# EAGLE design MRCS-BB-Wemos (EAGLE 7.7.0)
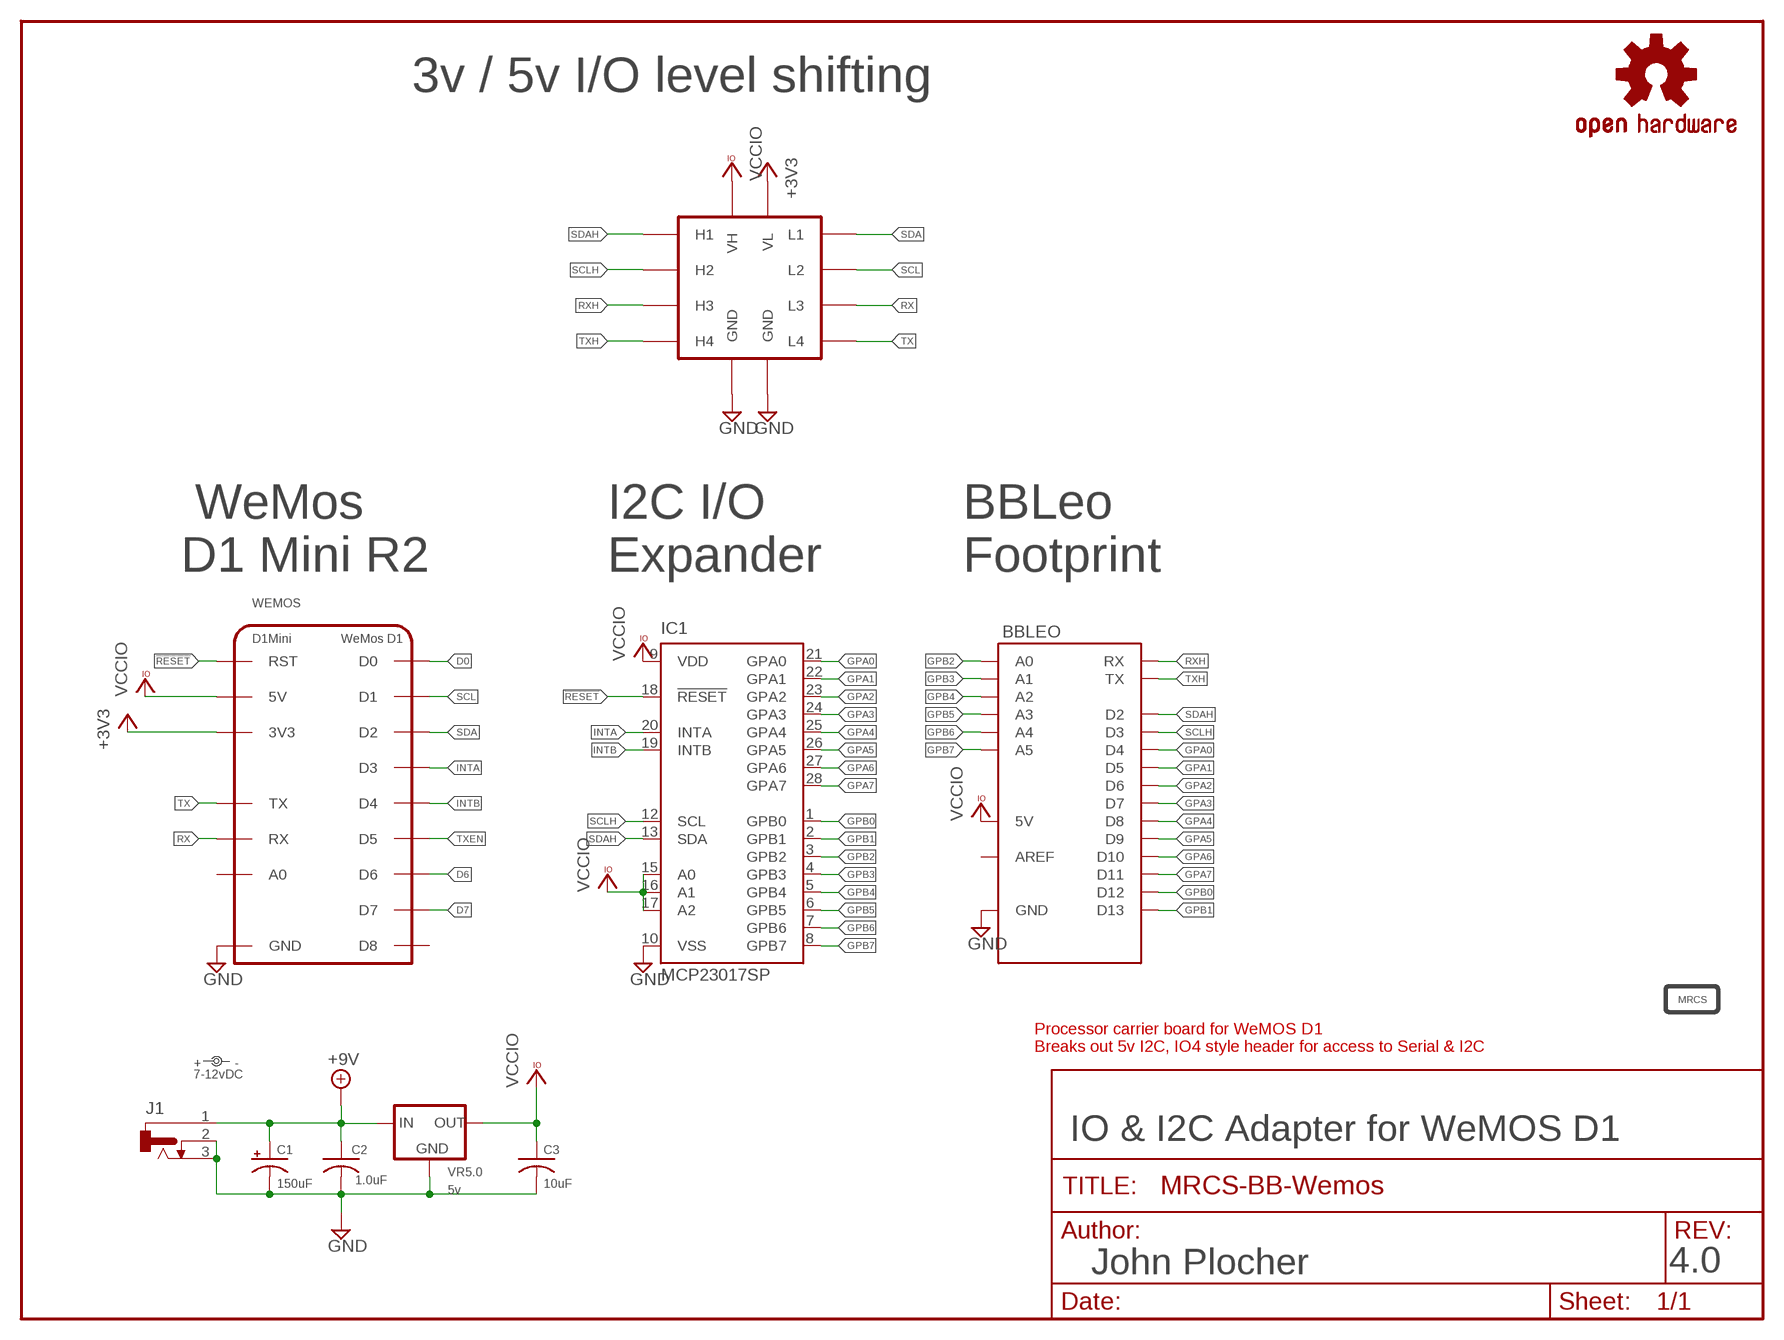
[diagram p0: schematic, sheet 1]

## Parts
BBLEO  ARDUINO-BBLEO  [ARDUINO-BBLEO]
C1  150uF  CAP-POLPTH-5MM  [E5-10.5]
C2  1.0uF  CAPPTH1  [C050-024X044]
C3  10uF  CAPPTH1  [C050-024X044]
IC1  MCP23017SP  [DIL28-3]
J1  CONNECTOR-DC-POWER-RA  [DCJ0202]
LABEL1  7-12vDC  DOC-POWER_LABEL  [PWR_LABEL]
LS2  I2C-LEVELSHIFTER  [MODULE]
OSHW1  DOC-OSHW-LOGO-L  [OSHW-LOGO-L]
U$1  DOC-MRCS-LOGOTOP  [MRCS-LOGO]
VR5.0  5v  VREG-PTH-RA-  [TO-220-RA]
WEMOS  D1Mini  WEMOS-D1V1  [WEMOS-D1]

## Nets
!RESET: IC1.18(!RESET) WEMOS.RST
+3V3: LS2.LV(VL) WEMOS.3V3
+9V [Feed]: C1.+ C2.1 J1.1 VR5.0.IN
D0 [signals]: WEMOS.D0
D6 [signals]: WEMOS.D6
D7 [signals]: WEMOS.D7
GND [signals]: BBLEO.GND@0(GND) BBLEO.GND@1(GND) BBLEO.GND@2(GND) BBLEO.GND@3(GND) BBLEO.GND@4(GND) C1.- C2.2 C3.2 IC1.10(VSS) J1.2 J1.3 LS2.GND@0(GND) LS2.GND@1(GND) VR5.0.GND WEMOS.GND
GPA0: BBLEO.D4 IC1.21(GPA0)
GPA1: BBLEO.D5 IC1.22(GPA1)
GPA2: BBLEO.D6 IC1.23(GPA2)
GPA3: BBLEO.D7 IC1.24(GPA3)
GPA4: BBLEO.D8 IC1.25(GPA4)
GPA5: BBLEO.D9 IC1.26(GPA5)
GPA6: BBLEO.D10 IC1.27(GPA6)
GPA7: BBLEO.D11 IC1.28(GPA7)
GPB0: BBLEO.D12 IC1.1(GPB0)
GPB1: BBLEO.D13 IC1.2(GPB1)
GPB2: BBLEO.A0 IC1.3(GPB2)
GPB3: BBLEO.A1 IC1.4(GPB3)
GPB4: BBLEO.A2 IC1.5(GPB4)
GPB5: BBLEO.A3 IC1.6(GPB5)
GPB6: BBLEO.A4 IC1.7(GPB6)
GPB7: BBLEO.A5 IC1.8(GPB7)
INTA [signals]: IC1.20(INTA) WEMOS.D3
INTB [signals]: IC1.19(INTB) WEMOS.D4
RX [signals]: LS2.L3 WEMOS.RX
RXH [signals]: BBLEO.RX LS2.H3
SCL [signals]: LS2.L2 WEMOS.D1
SCLH [signals]: BBLEO.SCL(D3) IC1.12(SCL) LS2.H2
SDA [signals]: LS2.L1 WEMOS.D2
SDAH [signals]: BBLEO.SDA(D2) IC1.13(SDA) LS2.H1
TX [signals]: LS2.L4 WEMOS.TX
TXEN [signals]: WEMOS.D5
TXH [signals]: BBLEO.TX LS2.H4
VCCIO [Power]: BBLEO.+5V@1(5V) BBLEO.+5V@2(5V) BBLEO.+5V@3(5V) BBLEO.+5V@4(5V) C3.1 IC1.9(VDD) IC1.15(A0) IC1.16(A1) IC1.17(A2) LS2.HV(VH) VR5.0.OUT WEMOS.5V
Unconnected: BBLEO.AR(AREF) WEMOS.A0 WEMOS.D8

## Notes on the sheet
- 3v / 5v I/O level shifting
- WeMos
  D1 Mini R2
- I2C I/O
  Expander
- BBLeo
  Footprint
- Processor carrier board for WeMOS D1
  Breaks out 5v I2C, IO4 style header for access to Serial & I2C
- IO & I2C Adapter for WeMOS D1
- John Plocher | 4.0

## Library data of the parts
BBLEO = SPCoast:ARDUINO-BBLEO
C1 = SPCoast:CAP-POL*
C2 C3 = SPCoast:CAP*
IC1 = SPCoast:MCP23017: http://ww1.microchip.com/downloads/en/DeviceDoc/21952a.pdf Source: http://ww1.microchip.com/downloads/en/DeviceDoc/21952a.pdf; MF: MICROCHIP; MPN: MCP23017-E/SP; OC_FARNELL: 1332088; OC_NEWARK: 31K2959
J1 = SPCoast:CONNECTOR-DC-POWER: DC POWER JACK
LABEL1 = SPCoast:DOC-POWER_LABEL
LS2 = SPCoast:I2C-LEVELSHIFTER
OSHW1 = SPCoast:DOC-OSHW-LOGO-: Open Source Hardware Logo This logo indicates the piece of hardware it is found on incorporates a OSHW license and/or adheres to the definition of open source hardware http://freedomdefined.org/OSHW Creative Commons - Attribution - ShareAlike 3.0
U$1 = SPCoast:DOC-MRCS-LOGO
VR5.0 = SPCoast:VREG-?-*: Voltage Regulator Standard linear regulator. 7805 uses IGO pinout LM1117 uses GOI pinout
WEMOS = SPCoast:WEMOS-D1

## Net classes
0 default: width 0.254 mm, drill 0.5 mm, clearance 0.203 mm
1 Power: width 0.254 mm, drill 0.8 mm, clearance 0.254 mm
2 signals: width 0.254 mm, drill 0.6 mm, clearance 0.254 mm
3 Feed: width 1.016 mm, drill 1.4 mm, clearance 0.254 mm

## Board
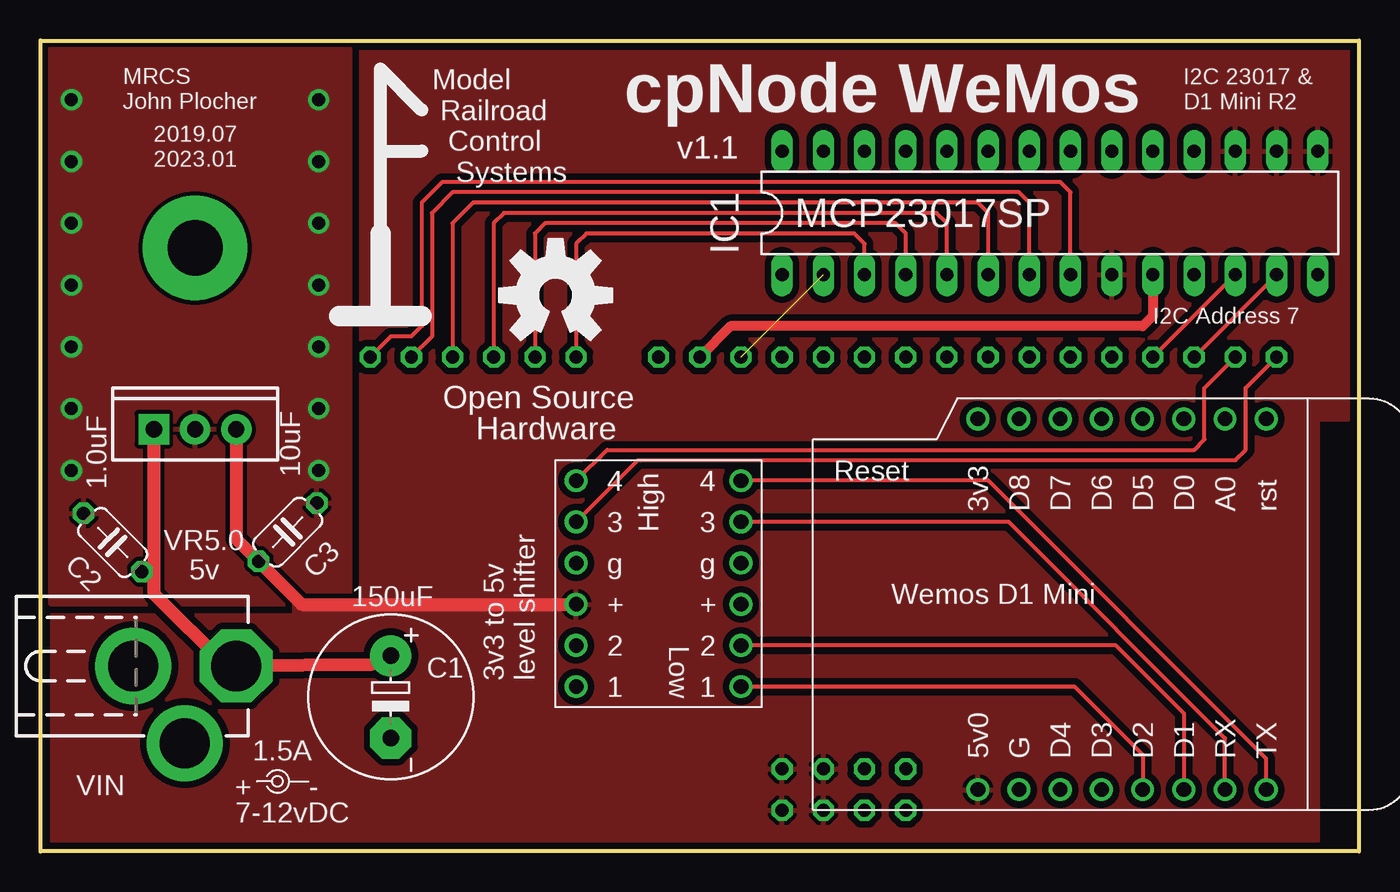
[diagram p1: board, top side]
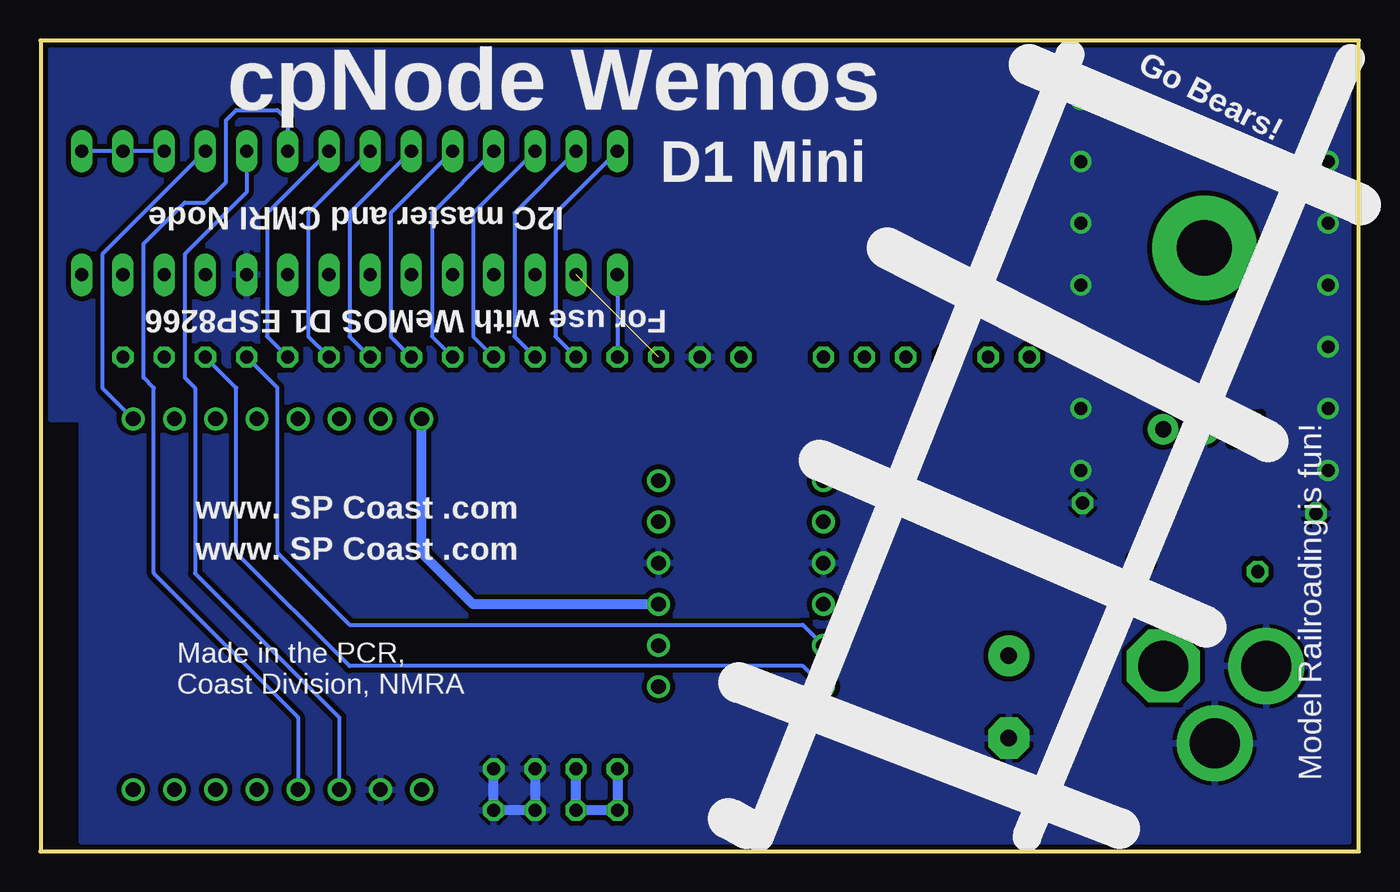
[diagram p2: board, bottom side, seen from below]

Size 81.28 x 50 mm. Coordinates in mm from the lower left corner, seen from the top.
Outline: 0,0 0,50 81.28,50 81.28,0 0,0
Copper layers (1*16): Top 0.035mm / dielectric 1.5mm / Bottom 0.035mm
Design rules "Fusion_eagle_rule_v1.1 *": minimum track width 8mil, minimum drill 0.6mm, track to track 6mil, track to pad 6mil, pad to pad 10mil, via to via 10mil, smd to smd 10mil, copper to edge 10mil, drill to drill 10mil, minimum pad ring 10mil, minimum via ring 10mil, stop-mask expansion 2mil, vias tented up to drill 100mil, thermal gap 10mil

### Footprints (pad centres in the part's own frame; a part is rotated, then mirrored left to right if it is on the bottom)
ARDUINO-BBLEO = drill 0.8 octagon: +5V@1 40.64,5.08; +5V@2 40.64,2.54; +5V@3 38.1,5.08; +5V@4 38.1,2.54; A0 25.4,30.48; A1 22.86,30.48; A2 20.32,30.48; A3 17.78,30.48; A4 15.24,30.48; A5 12.7,30.48; AR 30.48,30.48; D4 58.42,30.48; D5 55.88,30.48; D6 53.34,30.48; D7 50.8,30.48; D8 48.26,30.48; D9 45.72,30.48; D10 43.18,30.48; D11 40.64,30.48; D12 38.1,30.48; D13 35.56,30.48; GND@0 33.02,30.48; GND@1 43.18,5.08; GND@2 45.72,5.08; GND@3 43.18,2.54; GND@4 45.72,2.54; RX 68.58,30.48; SCL 60.96,30.48; SDA 63.5,30.48; TX 66.04,30.48
E5-10.5 = drill 1.016 pad 2.54: + -2.54,0 | drill 1.016 pad 2.54 octagon: - 2.54,0
C050-024X044 = drill 0.813 octagon: 1 -2.54,0; 2 2.54,0
DIL28-3 = drill 0.813 long: 1 -16.51,-3.81; 2 -13.97,-3.81; 3 -11.43,-3.81; 4 -8.89,-3.81; 5 -6.35,-3.81; 6 -3.81,-3.81; 7 -1.27,-3.81; 8 1.27,-3.81; 9 3.81,-3.81; 10 6.35,-3.81; 11 8.89,-3.81; 12 11.43,-3.81; 13 13.97,-3.81; 14 16.51,-3.81; 15 16.51,3.81; 16 13.97,3.81; 17 11.43,3.81; 18 8.89,3.81; 19 6.35,3.81; 20 3.81,3.81; 21 1.27,3.81; 22 -1.27,3.81; 23 -3.81,3.81; 24 -6.35,3.81; 25 -8.89,3.81; 26 -11.43,3.81; 27 -13.97,3.81; 28 -16.51,3.81
DCJ0202 = drill 3.1 pad 4.5 octagon: 1 0,3.175 | drill 3.1 pad 4.7: 2 4.763,0; 3 0,-3.175
MODULE = drill 0.9: GND@0 -5.08,1.27; GND@1 5.08,1.27; H1 -5.08,-6.35; H2 -5.08,-3.81; H3 -5.08,3.81; H4 -5.08,6.35; HV -5.08,-1.27; L1 5.08,-6.35; L2 5.08,-3.81; L3 5.08,3.81; L4 5.08,6.35; LV 5.08,-1.27
TO-220-RA = drill 1 pad 1.88: GND 0,0; OUT 2.54,0 | drill 1 pad 1.88 square: IN -2.54,0
WEMOS-D1 = drill 0.9: 3V3 -11.43,-7.62; 5V 11.43,-7.62; A0 -11.43,7.62; D0 -11.43,5.08; D1 11.43,5.08; D2 11.43,2.54; D3 11.43,0; D4 11.43,-2.54; D5 -11.43,2.54; D6 -11.43,0; D7 -11.43,-2.54; D8 -11.43,-5.08; GND 11.43,-5.08; RST -11.43,10.16; RX 11.43,7.62; TX 11.43,10.16

### Placement (x,y rotation side)
BBLEO  7.62,0 0 top
C1  21.59,9.53 270 top
C2  4.45,19.05 135 top
C3  15.24,19.68 45 top
IC1  62.23,39.37 0 top
J1  8.89,11.43 270 top
LABEL1  14.61,4.32 90 top
LS2  38.1,16.51 0 top
OSHW1  31.75,34.29 0 top
U$1  20.95,33.02 0 top
VR5.0  9.53,26.04 0 top
WEMOS  65.41,15.24 270 top

### Tracks (layer width: path | path; a pad name or v marks a point on that pad's centre or on a via)
!RESET
  Bottom 0.254: IC1.18 77.47,36.83 77.47,28.57 WEMOS.RST
+3V3
  Bottom 0.61: LS2.LV 54.61,15.24 57.78,18.41 WEMOS.3V3
+9V
  Top 0.813: VR5.0.IN 6.99,17.27 | 6.99,17.27 6.99,15.88 11.43,11.43 J1.1 20.37,11.51 C1.+ | C2.1 6.99,17.27
GND  (via drill 0.8)
  Top 0.61: IC1.10 68.58,33.02 67.94,32.38 42.55,32.38 BBLEO.GND@0
  Bottom 0.61: BBLEO.GND@1 BBLEO.GND@3 BBLEO.GND@4 BBLEO.GND@2
  other vias: 17.14,23.5 1.91,38.73 1.91,42.55 17.14,38.73 17.14,46.35 1.91,46.35 17.14,31.11 1.91,27.3 17.14,27.3 1.91,34.92 17.14,34.92 1.91,31.11 17.14,42.55 1.91,23.5
  pour Bottom (isolate 0.305, rank 2): 78.74,0.64 78.74,26.67 80.64,26.67 80.64,49.37 0.64,49.37 0.64,0.64
  pour Top (isolate 0): 0.64,49.53 19.05,49.53 19.05,15.24 0.64,15.24
GPA0
  Bottom 0.254: IC1.21 67.31,39.37 67.31,31.75 BBLEO.D4
GPA1
  Bottom 0.254: IC1.22 64.77,39.37 64.77,31.75 BBLEO.D5
GPA2
  Bottom 0.254: IC1.23 62.23,39.37 62.23,31.75 BBLEO.D6
GPA3
  Bottom 0.254: IC1.24 59.69,39.37 59.69,31.75 BBLEO.D7
GPA4
  Bottom 0.254: IC1.25 57.15,39.37 57.15,31.75 BBLEO.D8
GPA5
  Bottom 0.254: IC1.26 54.61,39.37 54.61,31.75 BBLEO.D9
GPA6
  Bottom 0.254: IC1.27 52.07,39.37 52.07,31.75 BBLEO.D10
GPA7
  Bottom 0.254: IC1.28 49.53,39.37 49.53,31.75 BBLEO.D11
GPB0
  Bottom 0.254: IC1.1 BBLEO.D12
GPB1  (1 unrouted)
GPB2
  Top 0.254: IC1.3 50.8,37.47 50.16,38.1 33.66,38.1 33.02,37.47 BBLEO.A0
GPB3
  Top 0.254: IC1.4 53.34,38.1 52.7,38.73 31.11,38.73 30.48,38.1 BBLEO.A1
GPB4
  Top 0.254: IC1.5 55.88,38.73 55.24,39.37 28.57,39.37 27.94,38.73 BBLEO.A2
GPB5
  Top 0.254: IC1.6 58.42,39.37 57.78,40.01 26.67,40.01 25.4,38.73 BBLEO.A3
GPB6
  Top 0.254: IC1.7 60.96,40.01 60.33,40.64 25.4,40.64 24.13,39.37 24.13,31.75 BBLEO.A4
GPB7
  Top 0.254: IC1.8 63.5,40.64 62.87,41.27 24.77,41.27 23.5,40.01 23.5,32.38 22.86,31.75 21.59,31.75 BBLEO.A5
INTA
  Bottom 0.254: WEMOS.D3 65.41,8.26 74.3,17.14 74.3,28.57 74.93,29.21 74.93,37.47 72.39,40.01 71.12,40.01 69.85,41.27 69.85,45.09 69.22,45.72 66.67,45.72 66.04,45.09 IC1.20
INTB
  Bottom 0.254: WEMOS.D4 62.87,8.26 71.75,17.14 71.75,28.57 72.39,29.21 72.39,36.83 68.58,40.64 IC1.19
N$1  (via drill 3.4 pad 6.45)
  other vias: 9.53,37.21
RX
  Top 0.254: WEMOS.RX 73.03,6.99 59.69,20.32 LS2.L3
RXH
  Top 0.254: LS2.H3 36.83,24.13 73.66,24.13 74.3,24.77 74.3,28.57 BBLEO.RX
SCL
  Top 0.254: WEMOS.D1 70.48,8.51 66.29,12.7 LS2.L2
SCLH
  Top 0.254: IC1.12 BBLEO.SCL
  Bottom 0.254: BBLEO.SCL 66.67,28.57 66.67,18.41 62.23,13.97 34.29,13.97 LS2.H2
SDA
  Top 0.254: WEMOS.D2 67.94,5.97 63.75,10.16 LS2.L1
SDAH
  Top 0.254: IC1.13 BBLEO.SDA
  Bottom 0.254: BBLEO.SDA 69.22,28.57 69.22,18.41 62.23,11.43 34.29,11.43 LS2.H1
TX
  Top 0.254: WEMOS.TX 75.56,5.71 58.42,22.86 LS2.L4
TXH
  Top 0.254: LS2.H4 34.92,24.77 71.12,24.77 71.75,25.4 71.75,28.57 BBLEO.TX
VCCIO
  Top 0.813: VR5.0.OUT 12.06,19.27 C3.1 16.09,15.24 LS2.HV
  Bottom 0.254: IC1.17 IC1.16 IC1.15
  Bottom 0.61: BBLEO.+5V@3 BBLEO.+5V@4 BBLEO.+5V@2 BBLEO.+5V@1
  pour Top (isolate 0.406, rank 2): 78.74,0.64 78.74,26.67 80.64,26.67 80.64,49.37 0.64,49.37 0.64,0.64

### Text on the board
tPlace: MRCS / John Plocher | cpNode WeMos | I2C 23017 & / D1 Mini R2 | v1.1 | 2019.07 / 2023.01 | MCP23017SP | I2C Address 7 | Open Source | Hardware | 10uF | 1.0uF | 5v | 150uF | Wemos D1 Mini | 3v3 to 5v / level shifter | 1.5A | VIN
bPlace: Go Bears! | cpNode Wemos | D1 Mini | I2C master and CMRI Node | For use with WeMOS D1 ESP8266 | www. SP Coast .com | www. SP Coast .com | Made in the PCR, / Coast Division, NMRA | Model Railroading is fun!
_tNames: IC1 | VR5.0 | C2 | C3 | C1